# EAGLE design LedDisplay (EAGLE 6.5.0)
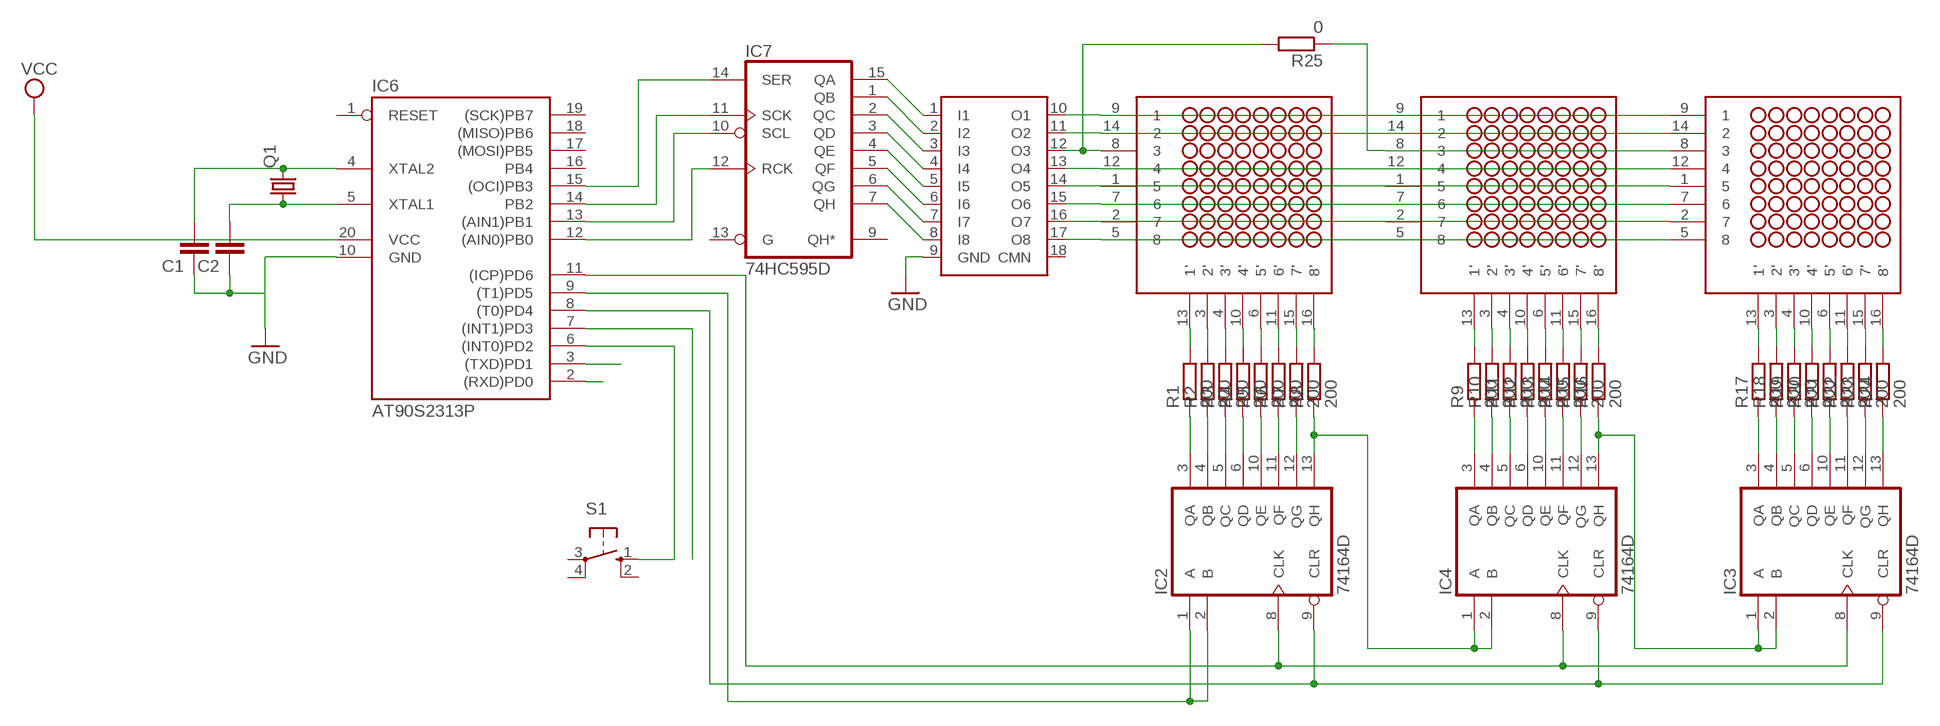
[diagram p0: schematic, sheet 1]

## Parts
C1  C2,5-3  [C2.5-3]
C2  C2,5-3  [C2.5-3]
IC2  74164D  [SO14]
IC3  74164D  [SO14]
IC4  74164D  [SO14]
IC6  AT90S2313P  [DIL20]
IC7  74HC595D  [SO16]
Q1  CRYSTALHC49U70  [HC49U70]
R1  200  R-EU_M1206  [M1206]
R2  200  R-EU_M1206  [M1206]
R3  200  R-EU_M1206  [M1206]
R4  200  R-EU_M1206  [M1206]
R5  200  R-EU_M1206  [M1206]
R6  200  R-EU_M1206  [M1206]
R7  200  R-EU_M1206  [M1206]
R8  200  R-EU_M1206  [M1206]
R9  200  R-EU_M1206  [M1206]
R10  200  R-EU_M1206  [M1206]
R11  200  R-EU_M1206  [M1206]
R12  200  R-EU_M1206  [M1206]
R13  200  R-EU_M1206  [M1206]
R14  200  R-EU_M1206  [M1206]
R15  200  R-EU_M1206  [M1206]
R16  200  R-EU_M1206  [M1206]
R17  200  R-EU_M1206  [M1206]
R18  200  R-EU_M1206  [M1206]
R19  200  R-EU_M1206  [M1206]
R20  200  R-EU_M1206  [M1206]
R21  200  R-EU_M1206  [M1206]
R22  200  R-EU_M1206  [M1206]
R23  200  R-EU_M1206  [M1206]
R24  200  R-EU_M1206  [M1206]
R25  0  R-EU_M1206  [M1206]
S1  10-XX  [B3F-10XX]
U$1  NFM-12881BG-11  [NFM-12881BG-11]
U$2  NFM-12881BG-11  [NFM-12881BG-11]
U$3  NFM-12881BG-11  [NFM-12881BG-11]
U$4  ULN2803A  [SO18W]

## Nets
GND: C1.1 C2.1 IC6.10(GND) U$4.9(GND)
N$1: IC7.7(QH) U$4.8(I8)
N$2: IC7.6(QG) U$4.7(I7)
N$3: IC7.5(QF) U$4.6(I6)
N$4: IC7.4(QE) U$4.5(I5)
N$5: IC7.3(QD) U$4.4(I4)
N$6: IC7.2(QC) U$4.3(I3)
N$7: IC7.1(QB) U$4.2(I2)
N$8: IC7.15(QA) U$4.1(I1)
N$9: R1.2 U$1.13(1')
N$10: R2.2 U$1.3(2')
N$11: R3.2 U$1.4(3')
N$12: R4.2 U$1.10(4')
N$13: R5.2 U$1.6(5')
N$14: R6.2 U$1.11(6')
N$15: R7.2 U$1.15(7')
N$16: R8.2 U$1.16(8')
N$17: IC2.3(QA) R1.1
N$18: IC2.4(QB) R2.1
N$19: IC2.5(QC) R3.1
N$20: IC2.6(QD) R4.1
N$21: IC2.10(QE) R5.1
N$22: IC2.11(QF) R6.1
N$23: IC2.12(QG) R7.1
N$24: IC2.13(QH) IC4.1(A) IC4.2(B) R8.1
N$25: R9.2 U$2.13(1')
N$26: R10.2 U$2.3(2')
N$27: R11.2 U$2.4(3')
N$28: R12.2 U$2.10(4')
N$29: R13.2 U$2.6(5')
N$30: R14.2 U$2.11(6')
N$31: R15.2 U$2.15(7')
N$32: R16.2 U$2.16(8')
N$33: IC4.3(QA) R9.1
N$34: IC4.4(QB) R10.1
N$35: IC4.5(QC) R11.1
N$36: IC4.6(QD) R12.1
N$37: IC4.10(QE) R13.1
N$38: IC4.11(QF) R14.1
N$39: IC4.12(QG) R15.1
N$40: IC3.1(A) IC3.2(B) IC4.13(QH) R16.1
N$41: R17.2 U$3.13(1')
N$42: R18.2 U$3.3(2')
N$43: R19.2 U$3.4(3')
N$44: R20.2 U$3.10(4')
N$45: R21.2 U$3.6(5')
N$46: R22.2 U$3.11(6')
N$47: R23.2 U$3.15(7')
N$48: R24.2 U$3.16(8')
N$49: IC3.3(QA) R17.1
N$50: IC3.4(QB) R18.1
N$51: IC3.5(QC) R19.1
N$52: IC3.6(QD) R20.1
N$53: IC3.10(QE) R21.1
N$54: IC3.11(QF) R22.1
N$55: IC3.12(QG) R23.1
N$56: IC3.13(QH) R24.1
N$57: C1.2 IC6.4(XTAL2) Q1.2
N$58: C2.2 IC6.5(XTAL1) Q1.1
N$59: IC6.2((RXD)PD0)
N$60: IC6.3((TXD)PD1)
N$61: IC2.9(CLR) IC3.9(CLR) IC4.9(CLR) IC6.8((T0)PD4)
N$62: IC2.1(A) IC2.2(B) IC6.9((T1)PD5)
N$63: IC2.8(CLK) IC3.8(CLK) IC4.8(CLK) IC6.11((ICP)PD6)
N$64: IC6.6((INT0)PD2) S1.1(S)
N$65: IC6.7((INT1)PD3)
N$66: U$1.9 U$2.9 U$3.9 U$4.10(O1)
N$67: U$1.14 U$2.14 U$3.14 U$4.11(O2)
N$68: R25.1 U$2.8 U$3.8
N$69: U$1.12 U$2.12 U$3.12 U$4.13(O4)
N$70: U$1.1 U$2.1 U$3.1 U$4.14(O5)
N$71: U$1.7 U$2.7 U$3.7 U$4.15(O6)
N$72: U$1.2 U$2.2 U$3.2 U$4.16(O7)
N$73: U$1.5 U$2.5 U$3.5 U$4.17(O8)
N$74: IC6.12((AIN0)PB0) IC7.12(RCK)
N$75: IC6.13((AIN1)PB1) IC7.10(SCL)
N$76: IC6.14(PB2) IC7.11(SCK)
N$77: IC6.15((OCI)PB3) IC7.14(SER)
N$78: R25.2 U$1.8 U$4.12(O3)
VCC: IC6.20(VCC)
Unconnected: IC6.1(RESET) IC6.16(PB4) IC6.17((MOSI)PB5) IC6.18((MISO)PB6) IC6.19((SCK)PB7) IC7.9(QH*) IC7.13(G) S1.2(S1) S1.3(P) S1.4(P1) U$4.18(CMN)

## Power pins joined to a net without a drawn wire
GND: IC2.7(GND) IC3.7(GND) IC4.7(GND) IC7.8(GND)
VCC: IC2.14(VCC) IC3.14(VCC) IC4.14(VCC) IC7.16(VCC)

## Library data of the parts
C1 C2 = capacitor-wima:C: CAPACITOR naming: grid - package width
IC2-IC4 = 74xx-us:74*164: 8-bit parallel out SHIFT REGISTER
IC6 = atmel:AT90S2313: MICROCONTROLLER 2 Kbytes FLASH 128 bytes SRAM 128 bytes EEPROM UART; OC_FARNELL: unknown; OC_NEWARK: unknown
IC7 = 74xx-eu:74*595: 8-bit SHIFT REGISTER, output latch
Q1 = crystal:CRYSTAL: CRYSTAL; OC_FARNELL: unknown; OC_NEWARK: unknown
R1-R25 = resistor:R-EU_: RESISTOR, European symbol
S1 = switch-omron:10-XX: OMRON SWITCH; MPN: B3F-1000; OC_FARNELL: 176432; OC_NEWARK: 36M3542
U$1-U$3 = led_matrix_8x8:NFM-12881BG-11: Futurlec 8x8 LED Matrix
U$4 = MJ:ULN2803A

## Board
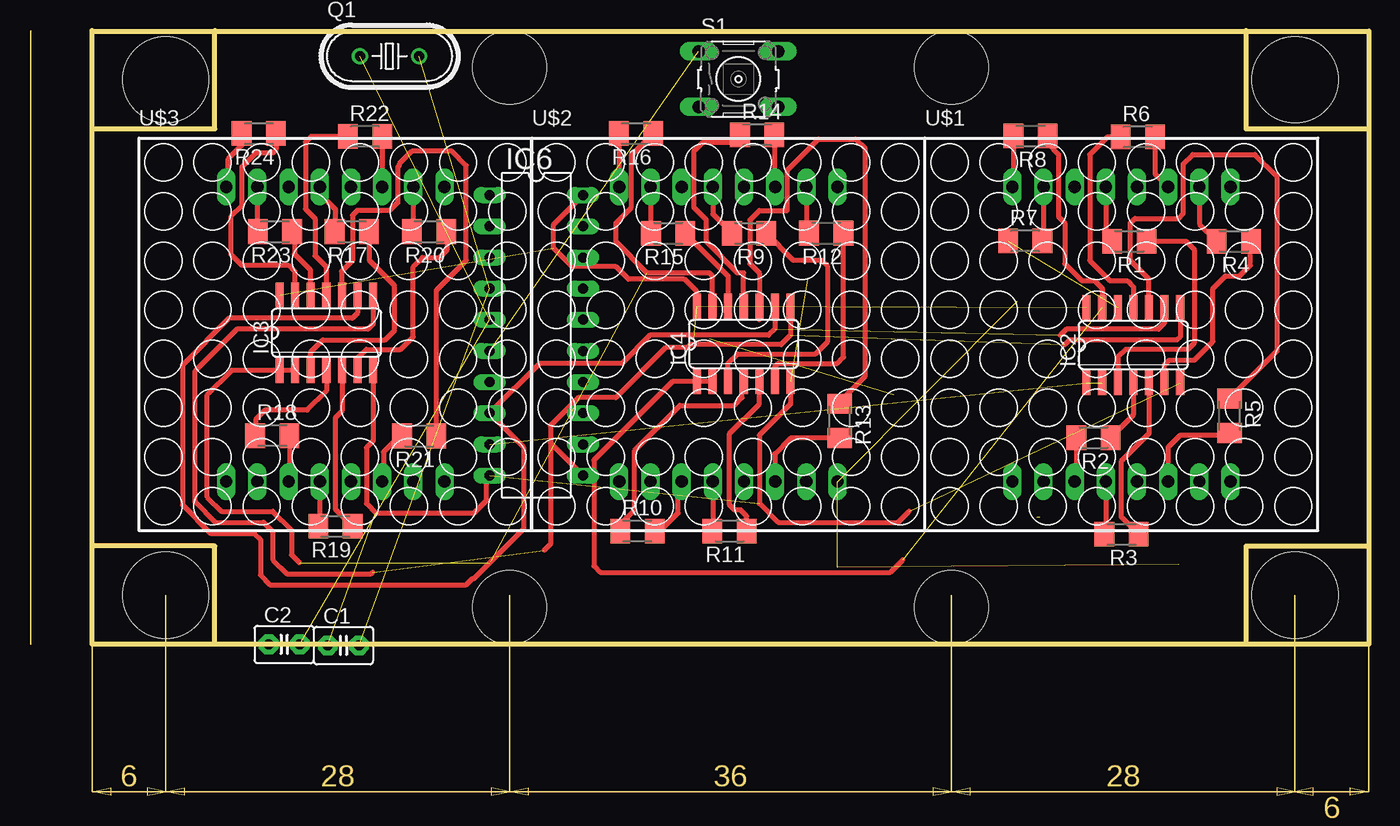
[diagram p1: board, top side]
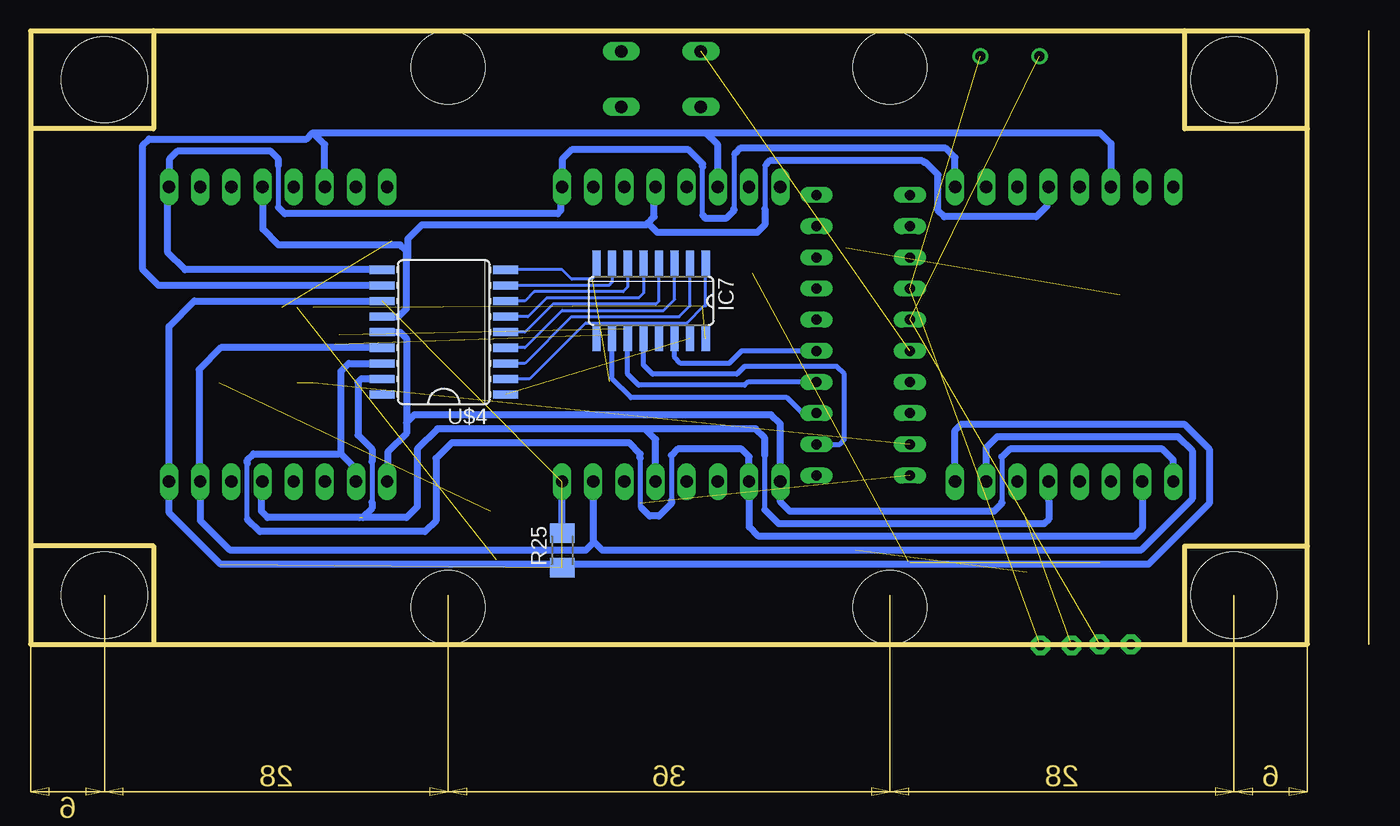
[diagram p2: board, bottom side, seen from below]

Size 104.01 x 50 mm. Coordinates in mm from the lower left corner, seen from the top.
Outline: 104,0 104,8
Outline: 104,8 104,42
Outline: 104,42 104,50 94,50
Outline: 94,50 10,50
Outline: 10,50 0,50 0,49.98
Outline: 0,8 0,0 10,0
Outline: 0,8 0,42
Outline: 0,42 0,49.98
Outline: 0,49.98 104.01,49.98 104.01,0 104,0
Outline: 104,0 94,0
Outline: 94,0 10,0
Outline: 10,0 10,8 0,8
Outline: 0,42 10,42 10,50
Outline: 94,50 94,42 104,42
Outline: 104,8 94,8 94,0
Copper layers (1*16): Top 0.035mm / dielectric 1.5mm / Bottom 0.035mm
Design rules "default": minimum track width 10mil, minimum drill 24mil, track to track 8mil, track to pad 8mil, pad to pad 8mil, via to via 8mil, smd to smd 8mil, copper to edge 40mil, drill to drill 8mil, minimum pad ring 10mil, minimum via ring 8mil, stop-mask expansion 4mil, vias tented up to drill 0mil, thermal gap 10mil
Holes 7 mm at 6,4 98,4 6,46 98,46
Holes 6 mm at 34,3 70,3 70,47 34,47

### Footprints (pad centres in the part's own frame; a part is rotated, then mirrored left to right if it is on the bottom)
C2.5-3 = drill 0.813 pad 1.6 octagon: 1 -1.27,0; 2 1.27,0
SO14 = smd 0.66 x 2.032: 1 -3.81,-3.073; 2 -2.54,-3.073; 3 -1.27,-3.073; 4 0,-3.073; 5 1.27,-3.073; 6 2.54,-3.073; 7 3.81,-3.073; 8 3.81,3.073; 9 2.54,3.073; 10 1.27,3.073; 11 0,3.073; 12 -1.27,3.073; 13 -2.54,3.073; 14 -3.81,3.073
DIL20 = drill 0.813 long: 1 -11.43,-3.81; 2 -8.89,-3.81; 3 -6.35,-3.81; 4 -3.81,-3.81; 5 -1.27,-3.81; 6 1.27,-3.81; 7 3.81,-3.81; 8 6.35,-3.81; 9 8.89,-3.81; 10 11.43,-3.81; 11 11.43,3.81; 12 8.89,3.81; 13 6.35,3.81; 14 3.81,3.81; 15 1.27,3.81; 16 -1.27,3.81; 17 -3.81,3.81; 18 -6.35,3.81; 19 -8.89,3.81; 20 -11.43,3.81
SO16 = smd 0.66 x 2.032: 1 -4.445,-3.073; 2 -3.175,-3.073; 3 -1.905,-3.073; 4 -0.635,-3.073; 5 0.635,-3.073; 6 1.905,-3.073; 7 3.175,-3.073; 8 4.445,-3.073; 9 4.445,3.073; 10 3.175,3.073; 11 1.905,3.073; 12 0.635,3.073; 13 -0.635,3.073; 14 -1.905,3.073; 15 -3.175,3.073; 16 -4.445,3.073
HC49U70 = drill 0.813: 1 -2.413,0; 2 2.413,0
M1206 = smd 1.6 x 2: 1 -1.4,0; 2 1.4,0
B3F-10XX = drill 1.016 long: 1 -3.251,2.261; 2 3.251,2.261; 3 -3.251,-2.261; 4 3.251,-2.261
NFM-12881BG-11 = drill 1 long: 1 -8.89,-12; 2 -6.35,-12; 3 -3.81,-12; 4 -1.27,-12; 5 1.27,-12; 6 3.81,-12; 7 6.35,-12; 8 8.89,-12; 9 8.89,12; 10 6.35,12; 11 3.81,12; 12 1.27,12; 13 -1.27,12; 14 -3.81,12; 15 -6.35,12; 16 -8.89,12
SO18W = smd 0.66 x 2.032: 1 -5.08,-5.029; 2 -3.81,-5.029; 3 -2.54,-5.029; 4 -1.27,-5.029; 5 0,-5.029; 6 1.27,-5.029; 7 2.54,-5.029; 8 3.81,-5.029; 9 5.08,-5.029; 10 5.08,5.029; 11 3.81,5.029; 12 2.54,5.029; 13 1.27,5.029; 14 0,5.029; 15 -1.27,5.029; 16 -2.54,5.029; 17 -3.81,5.029; 18 -5.08,5.029

### Placement (x,y rotation side)
C1  20.48,-0.1 0 top
C2  15.65,-0.01 0 top
IC2  84.83,24.38 0 top
IC3  19.09,25.39 0 top
IC4  53.09,24.48 0 top
IC6  36.2,25.18 270 top
IC7  53.47,27.97 180 bottom
Q1  24.23,47.92 0 top
R1  84.5,32.84 180 top
R2  81.58,16.84 180 top
R3  83.87,8.96 180 top
R4  93.01,32.84 180 top
R5  92.67,18.62 270 top
R6  85.19,41.33 0 top
R7  76.02,32.86 0 top
R8  76.46,41.42 180 top
R9  53.53,33.49 180 top
R10  44.43,9.23 0 top
R11  51.93,9.23 180 top
R12  59.81,33.51 180 top
R13  60.91,18.21 270 top
R14  54.18,41.51 0 top
R15  46.94,33.49 180 top
R16  44.31,41.61 180 top
R17  21.16,33.63 180 top
R18  14.68,17 0 top
R19  19.83,9.61 180 top
R20  27.46,33.63 180 top
R21  26.66,16.97 180 top
R22  22.24,41.37 0 top
R23  14.9,33.63 180 top
R24  13.59,41.62 180 top
R25  60.71,7.65 90 bottom
S1  52.66,46.06 0 top
U$1  83.86,25.26 0 top
U$2  51.84,25.26 0 top
U$3  19.82,25.26 0 top
U$4  70.36,25.43 90 bottom

### Tracks (layer width: path | path; a pad name or v marks a point on that pad's centre or on a via)
GND  (5 unrouted)
  Top 0.406: IC4.7 56.9,19.6 54.36,17.05 54.36,11.46 55.88,9.94 65.66,9.94 66.55,10.83 | IC3.7 22.9,16.58 22.35,16.03 22.35,11.46 23.11,10.7 31.11,10.7 32.13,11.72 32.13,13.49 IC6.10
  Bottom 0.254: IC7.8 57.91,30.13 58.29,29.75 59.94,29.75 60.71,30.51 U$4.9
N$1
  Bottom 0.254: IC7.7 56.64,29.5 56.9,29.24 U$4.8
N$2
  Bottom 0.254: IC7.6 55.37,29.11 55.75,28.73 62.99,28.73 63.75,27.97 U$4.7
N$3
  Bottom 0.254: IC7.5 54.1,28.61 54.48,28.23 61.98,28.23 63.5,26.7 U$4.6
N$4
  Bottom 0.254: IC7.4 52.83,27.97 53.09,27.72 61.47,27.72 63.75,25.43 U$4.5
N$5
  Bottom 0.254: IC7.3 51.56,28.1 52.45,27.21 60.71,27.21 63.75,24.16 U$4.4
N$6
  Bottom 0.254: IC7.2 50.29,27.59 51.18,26.7 59.94,26.7 63.75,22.89 U$4.3
N$7
  Bottom 0.254: IC7.1 49.02,27.59 49.15,27.59 50.55,26.19 58.8,26.19 63.37,21.62 U$4.2
N$8  (1 unrouted)
N$9
  Top 0.406: U$1.13 82.59,33.35 R1.2
N$10
  Top 0.406: R2.2 80.18,13.39 U$1.3
N$11
  Top 0.406: U$1.4 82.59,9.09 R3.2
N$12
  Top 0.406: U$1.10 90.21,34.24 R4.2
N$13
  Top 0.406: U$1.6 87.67,16.07 88.65,17.05 92.5,17.05 R5.2
N$14
  Top 0.406: R6.2 86.59,38.34 U$1.11
N$15
  Top 0.406: U$1.15 77.51,32.95 R7.2
N$16
  Top 0.406: R8.2 75.06,37.35 U$1.16
N$17
  Top 0.406: R1.1 89.11,32.84 89.79,32.16 89.79,24.54 89.28,24.04 84.2,24.04 83.57,23.4 IC2.3
N$18
  Top 0.406: IC2.4 84.83,18.68 R2.1
N$19
  Top 0.406: IC2.5 86.1,17.17 83.82,14.89 83.82,10.41 R3.1
N$20
  Top 0.406: IC2.6 87.37,22.76 87.76,23.15 89.79,23.15 91.31,24.67 91.31,28.99 92.33,30 93.47,30 94.36,30.89 94.36,32.79 R4.1
N$21
  Top 0.406: IC2.10 86.1,29.76 84.58,31.27 84.58,34.32 84.96,34.7 88.52,34.7 88.9,35.08 88.9,39.15 89.66,39.91 94.74,39.91 96.52,38.13 96.52,23.88 R5.1
N$22
  Top 0.406: R6.1 82.7,41.33 81.28,39.91 81.28,31.27 82.93,29.62 84.33,29.62 84.84,29.11 84.84,27.97 84.83,27.96 IC2.11
N$23  (1 unrouted)
N$24  (1 unrouted)
  Top 0.406: IC4.1 IC4.2 47.28,21.41 40.89,15.02 40.89,6.38 41.4,5.87 65.02,5.87 66.04,6.89 | R8.1 77.86,40.79 78.74,39.91 78.74,34.83 79.25,34.32 79.25,31.02 80.64,29.62 81.66,29.62 82.3,28.99 82.3,27.46 IC2.13
N$25
  Top 0.406: U$2.13 50.57,35.05 R9.2
N$26
  Top 0.406: R10.2 46.28,9.23 47.75,10.7 47.75,12.98 U$2.3
N$27
  Top 0.406: U$2.4 50.57,9.27 R11.2
N$28
  Top 0.406: U$2.10 58.19,33.73 R12.2
N$29
  Top 0.406: R13.2 56.91,16.81 55.63,15.53 55.63,13.28 U$2.6
N$30
  Top 0.406: R14.2 55.58,37.33 U$2.11
N$31
  Top 0.406: U$2.15 45.49,33.54 R15.2
N$32
  Top 0.406: R16.2 42.91,37.3 U$2.16
N$33
  Top 0.406: IC4.3 51.82,22.9 52.58,23.65 58.93,23.65 59.94,24.67 59.94,30.77 59.44,31.27 57.14,31.27 R9.1
N$34
  Top 0.406: R10.1 43.03,9.79 44.2,10.95 44.2,15.78 47.88,19.46 52.32,19.46 52.96,20.1 52.96,21.27 IC4.4
N$35
  Top 0.406: R11.1 53.33,10.45 52.83,10.95 52.32,10.95 51.94,11.34 51.94,17.18 54.36,19.59 IC4.5
N$36
  Top 0.406: IC4.6 55.63,22.64 55.88,22.89 60.71,22.89 61.21,23.4 61.21,32.8 61.47,33.05 61.47,33.25 R12.1
N$37
  Top 0.406: 54.36,26.45 IC4.10 54.36,30.26 53.59,31.02 53.59,34.58 54.36,35.34 56.64,35.34 56.64,38.64 59.18,41.18 62.23,41.18 62.99,40.42 62.99,21.88 60.91,19.79 R13.1
N$38
  Top 0.406: IC4.11 53.09,27.47 53.09,27.46 53.09,30.26 52.58,30.26 50.04,32.8 50.04,34.58 49.02,35.59 49.02,40.16 49.78,40.93 52.2,40.93 R14.1
N$39
  Top 0.406: R15.1 51.82,30 IC4.12
N$40  (2 unrouted)
  Top 0.406: IC4.13 50.55,30 50.29,30.26 45.21,30.26 42.67,32.8 42.67,34.32 43.94,35.59 43.94,39.84 R16.1 | 15.24,22.26 15.28,22.3 IC3.1 IC3.2 11.37,22.32 9.4,20.35 9.4,11.97 10.54,10.83 14.73,10.83 16.26,9.3 16.26,7.27 16.89,6.64 | 32.38,6.64 32.51,6.76
N$41
  Top 0.406: U$3.13 18.55,36.73 19.81,35.47 19.81,33.68 R17.2
N$42
  Top 0.406: R18.2 16.08,13.33 U$3.3
N$43
  Top 0.406: U$3.4 18.55,9.73
  Top 0.559: 18.55,9.73 R19.2
N$44
  Top 0.406: U$3.10 26.17,33.74 R20.2
N$45
  Top 0.406: R21.2 25.07,16.97 23.75,15.65 23.75,13.38 U$3.6
N$46
  Top 0.406: R22.2 U$3.11
N$47
  Top 0.406: U$3.15 13.47,33.65 R23.2
N$48
  Top 0.406: R24.2 12.19,40.67 11.05,39.53 11.05,37.38 U$3.16
N$49
  Top 0.406: IC3.3 17.82,23.82 18.8,24.8 23.88,24.8 24.64,25.56 24.64,29.24 22.61,31.27 22.61,33.58 R17.1
N$50
  Top 0.406: IC3.4 19.09,20.65 17.53,19.08 14.1,19.08 13.34,18.32 13.34,17.05 R18.1
N$51
  Top 0.406: 21.23,9.66 R19.1 19.81,11.03 19.81,18.45 20.36,19 IC3.5
N$52
  Top 0.406: IC3.6 21.59,22.36 21.59,23.27 22.35,24.04 25.15,24.04 26.16,25.05 26.16,30.77 26.92,31.53 28.32,31.53 28.96,32.16 28.96,33.53 R20.1
N$53
  Top 0.406: R21.1 28.06,28.85 30.48,31.27 30.48,39.02 29.34,40.16 26.04,40.16 25.02,39.15 25.02,39.02 24.89,38.89 24.89,35.97 24.26,35.34 21.59,35.34 21.21,34.96 21.21,31.27 20.32,30.38 20.32,28.51 IC3.10
N$54
  Top 0.406: R22.1 17.84,41.37 17.4,40.93 17.4,35.47 18.16,34.7 18.16,31.66 19.05,30.77 19.05,28.51 IC3.11
N$55
  Top 0.406: R23.1 16.48,33.81 16.48,31.81 17.78,30.51 17.78,28.51 IC3.12
N$56
  Top 0.406: R24.1 14.99,40.3 14.73,40.04 13.34,40.04 12.19,38.89 12.19,35.72 11.3,34.83 11.3,31.78 12.19,30.89 16,30.89 16.51,30.38 16.51,28.51 IC3.13
N$57  (2 unrouted)
N$58  (2 unrouted)
N$61  (1 unrouted)
  Top 0.406: IC4.9 55.63,25.69 55.12,25.18 45.47,25.18 43.18,22.89 36.45,22.89 IC6.8 35.18,16.03 35.18,9.43 31.11,5.37 30.99,5.37 30.48,4.86 14.48,4.86 13.72,5.62 13.72,8.54 13.21,9.05 9.65,9.05 7.37,11.34 7.37,22.77 11.18,26.57 21.21,26.57 21.63,27 IC3.9 | IC2.9 87.37,26.19 86.87,25.69 79.38,25.69 78.87,25.18
N$62  (2 unrouted)
N$63  (2 unrouted)
  Top 0.406: IC4.8 56.9,25.18 56.13,24.42 48.77,24.42 48.51,24.16 46.74,24.16 42.67,20.1 39.62,20.1 37.34,17.81 37.34,16.41 | 37.34,16.41 IC6.11 | IC3.8 22.9,26.11 22.48,25.69 11.81,25.69 8.38,22.26 8.38,11.59 10.03,9.94 13.97,9.94 14.73,9.18 14.73,6.89 15.88,5.75 22.73,5.75 22.86,5.87 | 37.34,16.41 37.34,8.16 36.83,7.65 | IC2.8 88.64,25.04 88.39,24.8 79.63,24.8 79.25,24.42
N$64  (1 unrouted)
N$66
  Bottom 0.406: 83.82,35.59 83.82,35.97 83.82,39.02 | 46.61,40.04 46.74,39.91 46.74,35.47 | 49.28,34.96 49.28,38.89
  Bottom 0.559: U$4.10 91.44,30.51 92.84,31.91 92.84,37.17 U$1.9 92.71,37.3 92.71,39.53 92.08,40.16 84.45,40.16 83.82,39.53 83.82,39.02 | U$3.9 28.71,39.66 29.46,40.42 46.23,40.42 46.61,40.04 | 46.74,35.47 46.74,35.34 47.37,34.7 49.02,34.7 49.28,34.96 | 49.28,38.89 49.28,39.15 50.42,40.29 59.94,40.29 60.71,39.53 60.71,37.28 U$2.9 60.83,37.16 60.83,35.34 61.09,35.08 83.31,35.08 83.82,35.59
N$67
  Bottom 0.559: U$4.11 93.6,29.24 94.87,30.51 94.87,40.67 94.36,41.18 81.53,41.18 81.03,41.69 | 81.03,41.69 49.02,41.69 | 49.02,41.69 16.89,41.69 16,40.8 U$3.14 | U$2.14 48.03,40.7 49.02,41.69 | U$1.14 80.05,40.71 81.03,41.69
N$68  (2 unrouted)
  Bottom 0.559: 92.71,13.22 92.71,10.7 88.52,6.51 12.95,6.51 8,11.46 8,15.91 10.03,17.94 28.19,17.94 28.71,17.42 U$3.8
N$69
  Bottom 0.406: 44.07,39.15 44.2,39.02 44.2,35.47
  Bottom 0.559: U$4.13 74.04,26.7 73.41,27.34 73.41,31.53 | 73.41,31.53 73.41,32.04 73.91,32.54 83.82,32.54 85.09,33.81 85.09,37.22 U$1.12 | U$3.12 21.09,37.23 21.21,37.12 21.21,35.72 22.1,34.83 29.59,34.83 30.1,35.34 30.1,38.26 31.11,39.27 31.24,39.27 31.37,39.4 43.81,39.4 44.07,39.15 | 73.41,31.53 73.28,31.53 73.28,33.05 72.14,34.2 53.85,34.2 53.72,34.32 | 53.72,34.32 53.21,34.83 53.21,37.16 U$2.12 | 44.2,35.47 44.2,34.2 44.83,33.56 52.96,33.56 53.72,34.32
N$70
  Bottom 0.406: 24.89,15.27 24.89,11.59
  Bottom 0.559: U$4.14 73.91,25.43 73.41,24.92 73.41,18.07 | 73.41,18.07 73.41,17.18 74.93,15.65 74.93,13.3 U$1.1 | 73.41,18.07 72.77,18.7 43.69,18.7 42.95,17.96 U$2.1 42.93,13.24 42.93,11.59 42.16,10.83 25.53,10.83 24.89,11.46 24.89,11.59 | U$3.1 10.93,15.03 11.81,15.91 24.26,15.91 24.89,15.27
N$71
  Bottom 0.559: U$4.15 88.52,24.16 90.3,22.38 90.3,13.35 U$1.7 90.17,13.22 90.17,10.06 87.76,7.65 58.8,7.65 58.19,8.26 58.19,8.41 | U$2.7 58.19,8.41 | U$3.7 26.17,16.03 25.27,16.92 10.54,16.92 9.4,15.78 9.4,11.84 13.59,7.65 57.43,7.65 58.19,8.41
N$72
  Bottom 0.406: 51.82,15.4 51.82,11.72 | 86.36,10.19 86.36,14.76 | 54.36,15.14 54.36,11.21 54.23,11.08
  Bottom 0.559: U$1.2 77.51,14.3 78.74,15.53 78.74,15.65 | 78.74,15.65 78.74,22.26 78.11,22.89 U$4.16 | 78.74,15.65 78.87,15.53 85.85,15.53 86.36,15.02 86.36,14.76 | 51.82,15.4 51.31,15.91 46.1,15.91 45.49,15.3 U$2.2 45.47,13.24 45.47,9.56 44.7,8.79 14.1,8.79 13.47,9.42 U$3.2 | 51.82,11.72 51.82,11.46 52.83,10.45 53.59,10.45 54.23,11.08 | 86.36,10.19 85.34,9.18 71.88,9.18 70.99,10.06 70.99,15.14 69.72,16.41 55.24,16.41 54.36,15.53 54.36,15.14
N$73  (1 unrouted)
  Bottom 0.406: 76.2,14.89 76.2,11.59 | 44.2,10.95 44.2,15.4
  Bottom 0.559: U$4.17 77.09,21.62 77.34,21.37 77.34,17.05 76.2,15.91 76.2,14.89 | 76.2,11.59 76.2,11.08 76.96,10.32 84.71,10.32 85.22,10.83 85.22,13.17 U$1.5 | U$2.5 53.11,16.69 53.98,17.56 | 53.98,17.56 70.87,17.56 72.52,15.91 72.52,11.21 73.41,10.32 77.22,10.32 | 44.2,15.4 44.2,16.8 44.96,17.56 53.98,17.56 | U$3.5 21.09,11.72 21.08,11.72 21.08,10.19 21.46,9.81 43.05,9.81 44.2,10.95
N$74
  Bottom 0.406: IC6.12 38.1,16.29 37.72,16.67 37.72,22 38.35,22.64 45.85,22.64 46.48,22 53.34,22 54.1,22.77 IC7.12
N$75
  Bottom 0.406: IC6.13 41.15,18.83 42.42,20.1 55.12,20.1 56.64,21.62 IC7.10
N$76
  Bottom 0.406: IC6.14 45.59,21.37 45.85,21.11 54.48,21.11 55.37,22 IC7.11
N$77
  Bottom 0.406: IC6.15 46.1,23.91 47.12,22.89 51.05,22.89 51.56,23.4 IC7.14
N$78  (1 unrouted)
  Bottom 0.559: U$1.8 92.75,25.9 90.68,27.97 U$4.12 | R25.2 60.71,13.24
VCC  (3 unrouted)
  Top 0.406: IC4.14 49.28,28.73 48.26,29.75 43.69,29.75 42.67,30.77 39.12,30.77 37.59,32.29 37.59,34.2 IC6.20